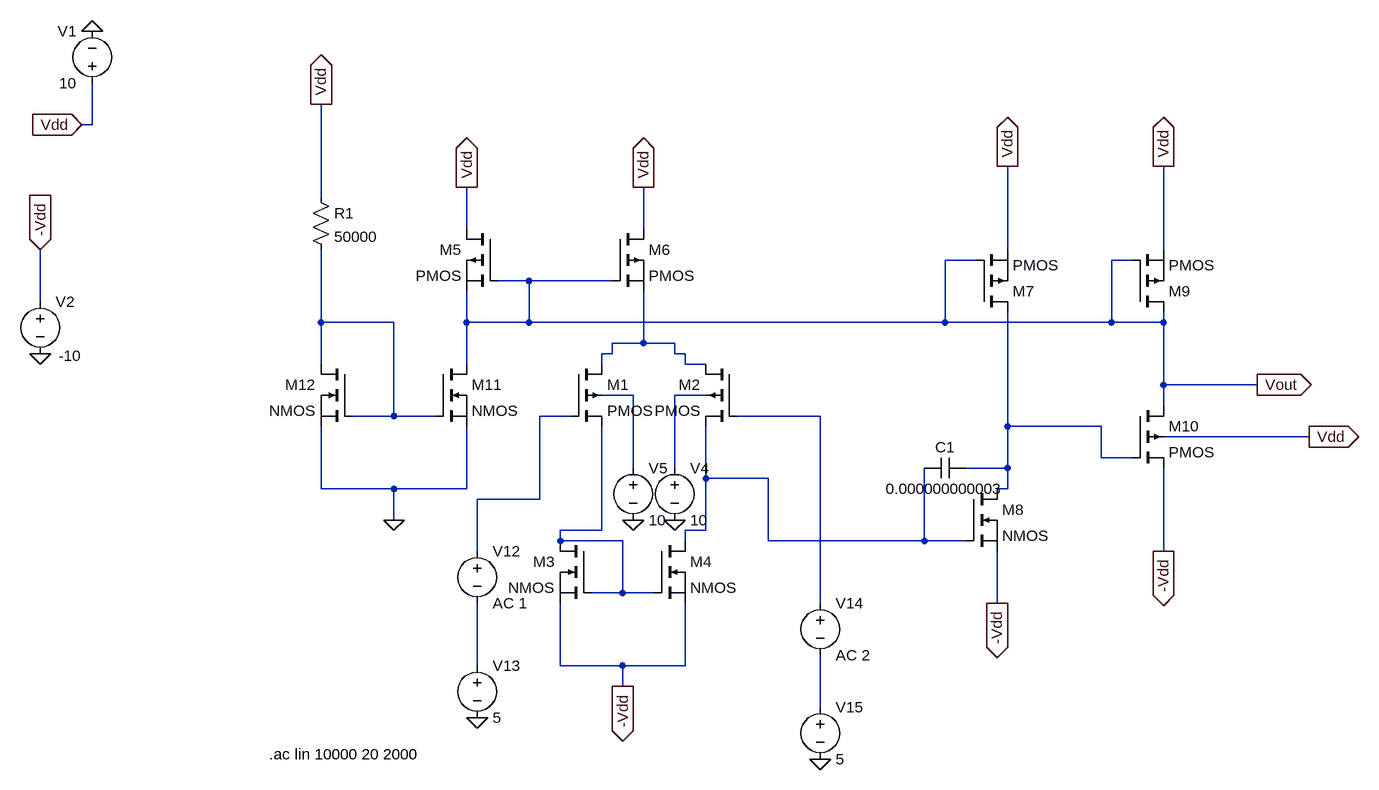
[diagram p0: schematic Op Amp Model.asc]
Op Amp Model.asc, the LTspice schematic file:
Version 4
SHEET 1 1400 724
WIRE -576 -272 -576 -336
WIRE -576 -272 -592 -272
WIRE -224 -160 -224 -304
WIRE 0 -112 0 -176
WIRE 272 -112 272 -176
WIRE 832 -80 832 -208
WIRE 1072 -80 1072 -208
WIRE 784 -64 736 -64
WIRE 1024 -64 992 -64
WIRE 96 -32 48 -32
WIRE 224 -32 96 -32
WIRE -656 0 -656 -80
WIRE -224 32 -224 -80
WIRE -112 32 -224 32
WIRE 0 32 0 -16
WIRE 96 32 96 -32
WIRE 96 32 0 32
WIRE 736 32 736 -64
WIRE 736 32 96 32
WIRE 992 32 992 -64
WIRE 992 32 736 32
WIRE 1072 32 1072 16
WIRE 1072 32 992 32
WIRE 272 64 272 -16
WIRE 272 64 224 64
WIRE 320 64 272 64
WIRE 224 80 224 64
WIRE 224 80 208 80
WIRE 320 80 320 64
WIRE 336 80 320 80
WIRE -224 96 -224 32
WIRE 0 96 0 32
WIRE 208 96 208 80
WIRE 336 96 336 80
WIRE 368 96 336 96
WIRE 1072 128 1072 32
WIRE 1216 128 1072 128
WIRE 256 144 208 144
WIRE 368 144 320 144
WIRE 1072 160 1072 128
WIRE -112 176 -112 32
WIRE -112 176 -176 176
WIRE -48 176 -112 176
WIRE 160 176 112 176
WIRE 544 176 416 176
WIRE 832 192 832 16
WIRE 976 192 832 192
WIRE 1296 208 1072 208
WIRE 976 240 976 192
WIRE 1024 240 976 240
WIRE 256 256 256 144
WIRE 320 256 320 144
WIRE 832 256 832 192
WIRE 832 256 768 256
WIRE 368 272 368 192
WIRE 464 272 368 272
WIRE -224 288 -224 192
WIRE -112 288 -224 288
WIRE 0 288 0 192
WIRE 0 288 -112 288
WIRE 832 288 832 256
WIRE 832 288 816 288
WIRE 112 304 112 176
WIRE 112 304 16 304
WIRE -112 336 -112 288
WIRE 208 352 208 192
WIRE 208 352 144 352
WIRE 368 352 368 272
WIRE 368 352 336 352
WIRE 144 368 144 352
WIRE 240 368 144 368
WIRE 336 368 336 352
WIRE 464 368 464 272
WIRE 704 368 704 256
WIRE 704 368 464 368
WIRE 768 368 704 368
WIRE 16 384 16 304
WIRE 1072 384 1072 256
WIRE 240 448 240 368
WIRE 240 448 192 448
WIRE 288 448 240 448
WIRE 544 464 544 176
WIRE 816 464 816 384
WIRE 16 560 16 464
WIRE 144 560 144 464
WIRE 240 560 144 560
WIRE 336 560 336 464
WIRE 336 560 240 560
WIRE 240 592 240 560
WIRE 544 624 544 544
FLAG 1216 128 Vout
IOPIN 1216 128 Out
FLAG -112 336 0
FLAG 256 336 0
FLAG 320 336 0
FLAG 16 640 0
FLAG 544 704 0
FLAG -592 -272 Vdd
IOPIN -592 -272 In
FLAG -576 -416 0
FLAG -224 -304 Vdd
IOPIN -224 -304 Out
FLAG 0 -176 Vdd
IOPIN 0 -176 Out
FLAG 272 -176 Vdd
IOPIN 272 -176 Out
FLAG 832 -208 Vdd
IOPIN 832 -208 Out
FLAG 1072 -208 Vdd
IOPIN 1072 -208 Out
FLAG 1296 208 Vdd
IOPIN 1296 208 Out
FLAG -656 80 0
FLAG -656 -80 -Vdd
IOPIN -656 -80 In
FLAG 240 592 -Vdd
IOPIN 240 592 Out
FLAG 816 464 -Vdd
IOPIN 816 464 Out
FLAG 1072 384 -Vdd
IOPIN 1072 384 Out
SYMBOL nmos 288 368 R0
SYMATTR InstName M4
SYMBOL nmos 192 368 M0
SYMATTR InstName M3
SYMBOL pmos 48 -112 M0
SYMATTR InstName M5
SYMBOL pmos 224 -112 R0
SYMATTR InstName M6
SYMBOL pmos 784 16 M180
SYMATTR InstName M7
SYMBOL pmos 1024 16 M180
SYMATTR InstName M9
SYMBOL nmos 768 288 R0
SYMATTR InstName M8
SYMBOL cap 768 240 R90
WINDOW 0 0 32 VBottom 2
WINDOW 3 32 32 VTop 2
SYMATTR InstName C1
SYMATTR Value 0.000000000003
SYMBOL pmos4 160 96 R0
SYMATTR InstName M1
SYMBOL pmos4 416 96 M0
SYMATTR InstName M2
SYMBOL pmos4 1024 160 R0
SYMATTR InstName M10
SYMBOL nmos -48 96 R0
SYMATTR InstName M11
SYMBOL nmos -176 96 M0
SYMATTR InstName M12
SYMBOL res -240 -176 R0
SYMATTR InstName R1
SYMATTR Value 50000
SYMBOL voltage -576 -320 R180
WINDOW 0 24 96 Left 2
WINDOW 3 24 16 Left 2
WINDOW 123 0 0 Left 2
WINDOW 39 0 0 Left 2
SYMATTR InstName V1
SYMATTR Value 10
SYMBOL voltage 320 240 R0
WINDOW 123 0 0 Left 2
WINDOW 39 0 0 Left 2
SYMATTR InstName V4
SYMATTR Value 10
SYMBOL voltage 256 240 R0
WINDOW 123 0 0 Left 2
WINDOW 39 0 0 Left 2
SYMATTR InstName V5
SYMATTR Value 10
SYMBOL voltage 16 368 R0
SYMATTR InstName V12
SYMATTR Value AC 1
SYMBOL voltage 16 544 R0
WINDOW 123 0 0 Left 2
WINDOW 39 0 0 Left 2
SYMATTR InstName V13
SYMATTR Value 5
SYMBOL voltage 544 448 R0
SYMATTR InstName V14
SYMATTR Value AC 2
SYMBOL voltage 544 608 R0
WINDOW 123 0 0 Left 2
WINDOW 39 0 0 Left 2
SYMATTR InstName V15
SYMATTR Value 5
SYMBOL voltage -656 -16 R0
WINDOW 3 28 99 Left 2
WINDOW 123 0 0 Left 2
WINDOW 39 0 0 Left 2
SYMATTR InstName V2
SYMATTR Value -10
TEXT -304 696 Left 2 !.ac lin 10000 20 2000

The netlist it stands for:
* Op Amp Model.asc
M4 N008 N009 -Vdd -Vdd NMOS
M3 N009 N009 -Vdd -Vdd NMOS
M5 Vdd Vout Vout Vout PMOS
M6 Vdd Vout N002 N002 PMOS
M7 N007 Vout Vdd Vdd PMOS
M9 Vout Vout Vdd Vdd PMOS
M8 N007 N008 -Vdd -Vdd NMOS
C1 N007 N008 0.000000000003
M1 N002 N005 N009 N003 PMOS
M2 N002 N006 N008 N004 PMOS
M10 Vout N007 -Vdd Vdd PMOS
M11 Vout N001 0 0 NMOS
M12 N001 N001 0 0 NMOS
R1 Vdd N001 50000
V1 Vdd 0 10
V4 N004 0 10
V5 N003 0 10
V12 N005 N010 AC 1
V13 N010 0 5
V14 N006 N011 AC 2
V15 N011 0 5
V2 -Vdd 0 -10
.model NMOS NMOS
.model PMOS PMOS
.lib standard.mos
.ac lin 10000 20 2000
.backanno
.end